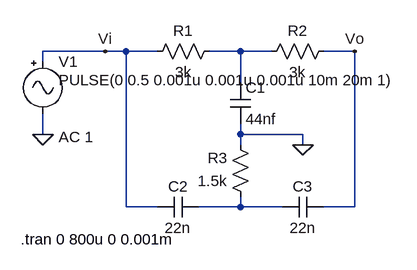
[diagram p0: schematic montecarlo_punto1.asc]
montecarlo_punto1.asc, the LTspice schematic file:
Version 4
SHEET 1 880 680
WIRE 16 160 -80 160
WIRE 48 160 16 160
WIRE 96 160 48 160
WIRE 224 160 176 160
WIRE 272 160 224 160
WIRE 400 160 352 160
WIRE -80 176 -80 160
WIRE 224 208 224 160
WIRE -80 288 -80 256
WIRE 224 288 224 272
WIRE 320 288 224 288
WIRE 224 304 224 288
WIRE 320 304 320 288
WIRE 48 400 48 160
WIRE 96 400 48 400
WIRE 224 400 224 384
WIRE 224 400 160 400
WIRE 288 400 224 400
WIRE 400 400 400 160
WIRE 400 400 352 400
FLAG 320 304 0
FLAG -80 288 0
FLAG 400 160 Vo
FLAG 16 160 Vi
SYMBOL res 192 144 R90
WINDOW 0 0 56 VBottom 2
WINDOW 3 32 56 VTop 2
SYMATTR InstName R1
SYMATTR Value 3k
SYMBOL res 368 144 R90
WINDOW 0 0 56 VBottom 2
WINDOW 3 32 56 VTop 2
SYMATTR InstName R2
SYMATTR Value 3k
SYMBOL res 240 400 R180
WINDOW 0 36 76 Left 2
WINDOW 3 36 40 Left 2
SYMATTR InstName R3
SYMATTR Value 1.5k
SYMBOL cap 208 208 R0
SYMATTR InstName C1
SYMATTR Value 44nf
SYMBOL cap 160 384 R90
WINDOW 0 0 32 VBottom 2
WINDOW 3 32 32 VTop 2
SYMATTR InstName C2
SYMATTR Value 22n
SYMBOL cap 352 384 R90
WINDOW 0 0 32 VBottom 2
WINDOW 3 32 32 VTop 2
SYMATTR InstName C3
SYMATTR Value 22n
SYMBOL Misc\\signal -80 160 R0
WINDOW 123 24 132 Left 2
WINDOW 39 0 0 Left 2
WINDOW 3 24 44 Left 2
SYMATTR Value2 AC 1
SYMATTR InstName V1
SYMATTR Value PULSE(0 0.5 0.001u 0.001u 0.001u 10m 20m 1)
TEXT -114 450 Left 2 !.tran 0 800u 0 0.001m

The netlist it stands for:
* montecarlo_punto1.asc
R1 N001 Vi 3k
R2 Vo N001 3k
R3 N002 0 1.5k
C1 N001 0 44nf
C2 N002 Vi 22n
C3 Vo N002 22n
V1 Vi 0 PULSE(0 0.5 0.001u 0.001u 0.001u 10m 20m 1) AC 1
.tran 0 800u 0 0.001m
.backanno
.end